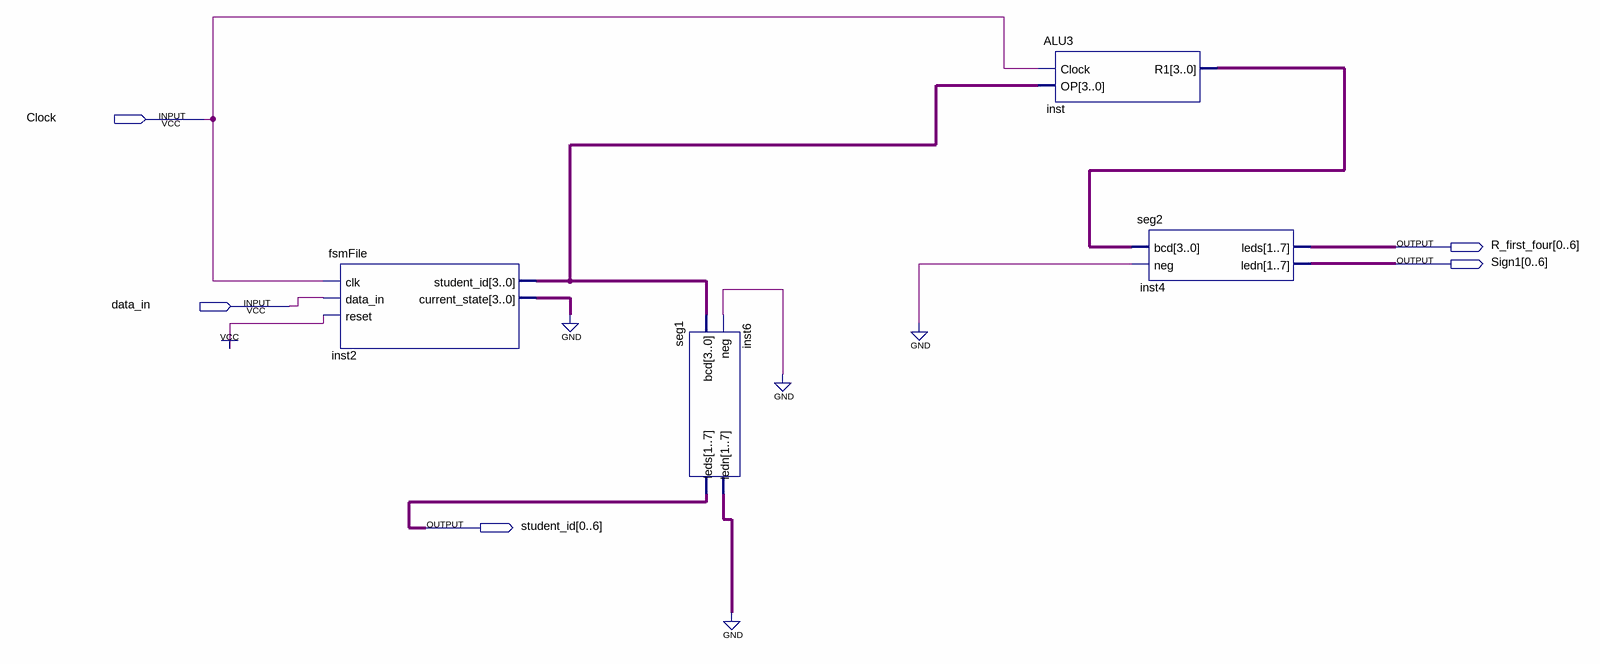
[diagram p0: schematic sheet]
// Quartus schematic Block3Test.bdf as structural Verilog: 4 symbols, 5 pins
module Block3Test (
  input  Clock,
  input  data_in,
  output [0:6] R_first_four,
  output [0:6] Sign1,
  output [0:6] student_id
);

  wire [3:0] inst2_current_state, inst2_student_id, inst_r1;
  wire [6:0] inst6_ledn;

  fsmFile inst2 (
    .clk(Clock), .data_in(data_in), .reset(1'b1), .student_id(inst2_student_id),
    .current_state(inst2_current_state));
  seg1 inst6 (.bcd(inst2_student_id), .neg(1'b0), .leds(student_id), .ledn(inst6_ledn));
  ALU3 inst (.Clock(Clock), .OP(inst2_student_id), .R1(inst_r1));
  seg2 inst4 (.bcd(inst_r1), .neg(1'b0), .leds(R_first_four), .ledn(Sign1));
  // also tied to GND on the sheet: {inst6_ledn[0], inst6_ledn[1], inst6_ledn[2], inst6_ledn[3], inst6_ledn[4], inst6_ledn[5], inst6_ledn[6], inst2_current_state[0], inst2_current_state[1], inst2_current_state[2], inst2_current_state[3]}
endmodule
